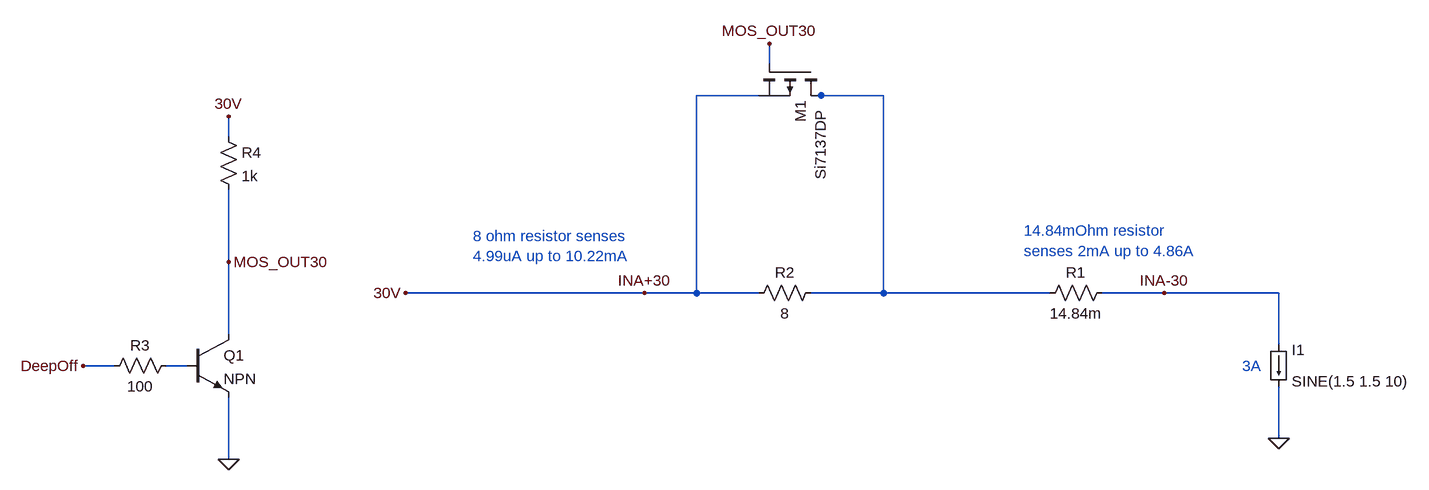
[diagram p0: schematic Draft1.asc]
Draft1.asc, the LTspice schematic file:
Version 4.1
SHEET 1 1268 680
WIRE 256 -624 256 -656
WIRE 240 -576 144 -576
WIRE 336 -576 320 -576
WIRE 432 -576 336 -576
WIRE -576 -512 -576 -544
WIRE -576 -320 -576 -432
WIRE 64 -272 -304 -272
WIRE 144 -272 144 -576
WIRE 144 -272 64 -272
WIRE 240 -272 144 -272
WIRE 432 -272 432 -576
WIRE 432 -272 320 -272
WIRE 688 -272 432 -272
WIRE 864 -272 768 -272
WIRE 1040 -272 864 -272
WIRE -576 -208 -576 -320
WIRE 1040 -192 1040 -272
WIRE -752 -160 -800 -160
WIRE -640 -160 -672 -160
WIRE 1040 -48 1040 -128
WIRE -576 -16 -576 -112
FLAG 64 -272 INA+30
FLAG 864 -272 INA-30
FLAG 1040 -48 0
FLAG -576 -320 MOS_OUT30
FLAG -576 -16 0
FLAG -800 -160 DeepOff
FLAG 256 -656 MOS_OUT30
FLAG -576 -544 30V
FLAG -304 -272 30V
SYMBOL res 672 -256 R270
WINDOW 0 32 56 VTop 2
WINDOW 3 0 56 VBottom 2
SYMATTR InstName R1
SYMATTR Value 14.84m
SYMBOL res 224 -256 R270
WINDOW 0 32 56 VTop 2
WINDOW 3 0 56 VBottom 2
SYMATTR InstName R2
SYMATTR Value 8
SYMBOL pmos 336 -624 R90
WINDOW 3 70 1 Left 2
SYMATTR Value Si7137DP
SYMATTR InstName M1
SYMBOL load 1024 -192 R0
WINDOW 123 0 0 Left 0
WINDOW 39 0 0 Left 0
SYMATTR InstName I1
SYMATTR Value SINE(1.5 1.5 10)
SYMBOL npn -640 -208 R0
SYMATTR InstName Q1
SYMBOL res -656 -176 R90
WINDOW 0 0 56 VBottom 2
WINDOW 3 32 56 VTop 2
SYMATTR InstName R3
SYMATTR Value 100
SYMBOL res -592 -528 R0
SYMATTR InstName R4
SYMATTR Value 1k
TEXT -200 -360 Left 2 ;8 ohm resistor senses\n4.99uA up to 10.22mA
TEXT 648 -368 Left 2 ;14.84mOhm resistor\nsenses 2mA up to 4.86A
TEXT 984 -160 Left 2 ;3A

The netlist it stands for:
* Draft1.asc
R1 N001 INA-30 14.84m
R2 30V N001 8
M1 N001 MOS_OUT30 30V 30V Si7137DP
I1 INA-30 0 SINE(1.5 1.5 10)
Q1 MOS_OUT30 N002 0 0 NPN
R3 N002 DeepOff 100
R4 30V MOS_OUT30 1k
.model NPN NPN
.model PNP PNP
.lib standard.bjt
.model NMOS NMOS
.model PMOS PMOS
.lib standard.mos
* 8 ohm resistor senses
* 4.99uA up to 10.22mA
* 14.84mOhm resistor
* senses 2mA up to 4.86A
* 3A
.backanno
.end